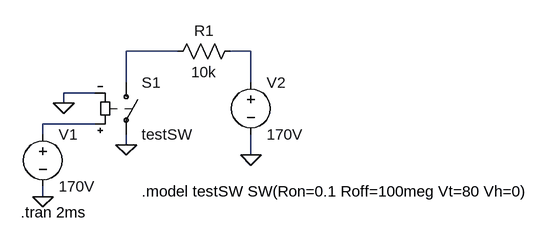
[diagram p0: schematic voltage controlled switch test.asc]
voltage controlled switch test.asc, the LTspice schematic file:
Version 4
SHEET 1 880 680
WIRE 64 80 -16 80
WIRE 176 80 144 80
WIRE -16 128 -16 80
WIRE 176 128 176 80
WIRE -64 144 -112 144
WIRE -112 160 -112 144
WIRE -64 192 -144 192
WIRE -144 208 -144 192
WIRE -16 224 -16 208
WIRE 176 240 176 208
WIRE -144 304 -144 288
FLAG -112 160 0
FLAG -16 224 0
FLAG -144 304 0
FLAG 176 240 0
SYMBOL sw -16 112 R0
SYMATTR InstName S1
SYMATTR Value testSW
SYMBOL res 160 64 R90
WINDOW 0 0 56 VBottom 2
WINDOW 3 32 56 VTop 2
SYMATTR InstName R1
SYMATTR Value 10k
SYMBOL voltage -144 192 R0
WINDOW 123 0 0 Left 0
WINDOW 39 0 0 Left 0
SYMATTR InstName V1
SYMATTR Value 170V
SYMBOL voltage 176 112 R0
WINDOW 123 0 0 Left 0
WINDOW 39 0 0 Left 0
SYMATTR InstName V2
SYMATTR Value 170V
TEXT -178 328 Left 2 !.tran 2ms
TEXT 8 296 Left 2 !.model testSW SW(Ron=0.1 Roff=100meg Vt=80 Vh=0)

The netlist it stands for:
* voltage controlled switch test.asc
S1 N001 0 N003 0 testSW
R1 N002 N001 10k
V1 N003 0 170V
V2 N002 0 170V
.tran 2ms
.model testSW SW(Ron=0.1 Roff=100meg Vt=80 Vh=0)
.backanno
.end